# Altium schematic sheet USB.SchDoc: USB-PROGRAMMER
size A4; Engineer: M.GUENI; Revision: R0; SheetNumber: 6; SheetTotal: 8
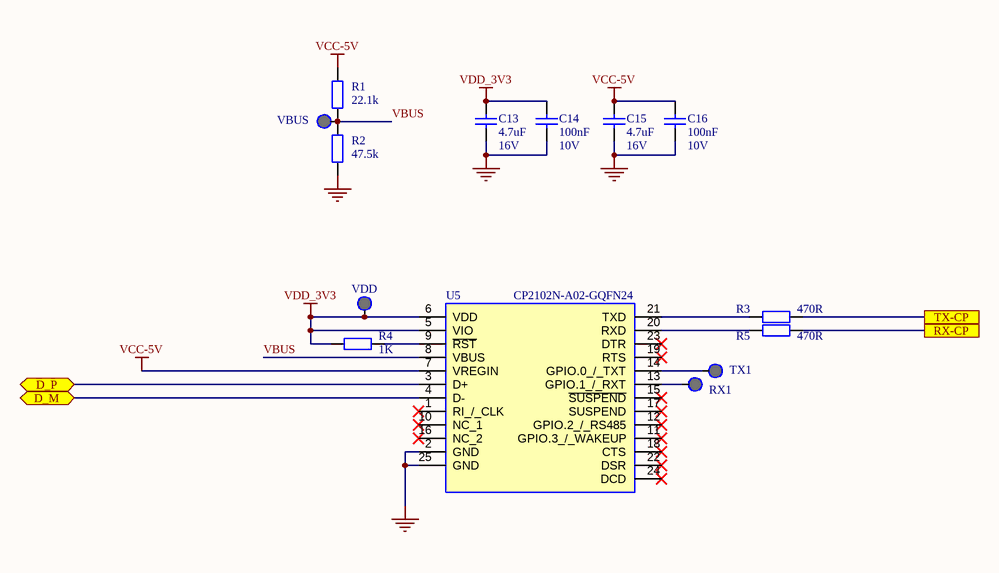
[diagram p0: USB.SchDoc]

## Parts
C13  Value 1: 4.7uF  Value 2: 16V  [CAPC1608N]  (hidden comment: Capacitor)
C14  Value 1: 100nF  Value 2: 10V  [CAPC1608N]  (hidden comment: Capacitor)
C15  Value 1: 4.7uF  Value 2: 16V  [CAPC1608N]  (hidden comment: Capacitor)
C16  Value 1: 100nF  Value 2: 10V  [CAPC1608N]  (hidden comment: Capacitor)
R1  Value 1: 22.1k  [RESC1608N]  (hidden comment: Resistor)
R2  Value 1: 47.5k  [RESC1608N]  (hidden comment: Resistor)
R3  Value 1: 470R  [RESC1608N]  (hidden comment: Resistor)
R4  Value 1: 1K  [RESC1608N]  (hidden comment: Resistor)
R5  Value 1: 470R  [RESC1608N]  (hidden comment: Resistor)
RX1  Test Point  [TP]  (value not drawn)  (no BOM)
TX1  Test Point  [TP]  (value not drawn)  (no BOM)
U5  CP2102N-A02-GQFN24  [QFN-24]
VBUS  Test Point  [TP]  (value not drawn)  (no BOM)
VDD  Test Point  [TP]  (value not drawn)  (no BOM)

## Ports
D_M (bidir), D_P (bidir), RX-CP, TX-CP

## Nets
GND: C13.1 C14.1 C15.1 C16.1 R2.2 U5.2(GND) U5.25(GND)
VCC-5V: C15.2 C16.2 R1.1 U5.7(VREGIN)
VDD_3V3: C13.2 C14.2 R4.1 U5.5(VIO) U5.6(VDD) VDD.1
D_M: U5.4(D-) ; port D_M
D_P: U5.3(D+) ; port D_P
RX-CP: R5.1 ; port RX-CP
TX-CP: R3.1 ; port TX-CP
VBUS: R1.2 R2.1 U5.8(VBUS) VBUS.1
NetR3_2: R3.2 U5.21(TXD)
NetR4_2: R4.2 U5.9(~{RST})
NetR5_2: R5.2 U5.20(RXD)
NetRX1_1: RX1.1 U5.13(GPIO.1_/_RXT)
NetTX1_1: TX1.1 U5.14(GPIO.0_/_TXT)

Not connected (* = marked no-connect by the designer): U5 1(RI_/_CLK)* 10(NC_1)* 11(GPIO.3_/_WAKEUP)* 12(GPIO.2_/_RS485)* 15(~{SUSPEND})* 16(NC_2)* 17(SUSPEND)* 18(CTS)* 19(RTS)* 22(DSR)* 23(DTR)* 24(DCD)*

## Notes on the sheet
- THIS DOCUMENT AND THE DATA DISCLOSED HEREIN OR
- HEREWITH IS THE PROPERTY OF ALTIUM LIMITED AND MAY
- DWG NO:
- REVISION
- REV:
- DESCRIPTION
- DATE
- APPROVED
- BE FREELY DISTRIBUTED IN WHOLE. NO RIGHTS ARE
- RESERVED OR EXPRESS OR IMPLIED WARANTEE GIVEN.
- ENG:
- APPROVALS
- PROJECT
- DSN:
- CHK:
- REFERENCE DOCUMENTS
- PROJECT REVISION:
- TITLE
- DOCUMENT REVISION:
- DESIGN ITEM:
- BOM:
- FAB DWG:
- PCB DWG:
- ASSY DWG:
- SCALE:
- A3
- SIZE
- CAGE CODE
- FILE NAME
- DWG NO.
- SHEET
- OF
- REV

## Library data of the parts
C13 C15 = CAP-000000047: MAN: Murata Electronics; MANREF: GRM188C71C475KE21D; DES: Multilayer Ceramic Capacitors MLCC - SMD/SMT 4.7UF 16V 10% 0603; TOL: 10%; FTP: 0603; SUP: Mouser; SUPREF: 81-GRM188C71C475KE1D; NOTE: _; Part Number: CAP-000000047
C14 C16 = CAP-000000005: MAN: KEMET; MANREF: C0603X104K8RACTU; DES: C0603X104K8RACTU -  Condensateur céramique multicouche CMS, 0.1 µF, 10 V, 0603 [1608 Metric], ± 10%, X7R; TOL: 10%; FTP: 0603; SUP: Farnell; SUPREF: 2904937; NOTE: _; Part Number: CAP-000000005
R1 = RES-000000017: MAN: Panasonic; MANREF: ERA-3AED2212V; DES: Thin Film Resistors - SMD 0603 22.1Kohms 25ppm 0.5% AEC-Q200; Value 2: 0.1W; TOL: 0.5%; FTP: 0603; SUP: Mouser; SUPREF: 667-ERA-3AED2212V; NOTE: _; Part Number: RES-000000017
R2 = RES-000000018: MAN: Vishay / Dale; MANREF: CRCW060347K5FKEA; DES: Thick Film Resistors - SMD 1/10watt 47.5Kohms 1%; Value 2: 0.1W; TOL: 1%; FTP: 0603; SUP: Mouser; SUPREF: 71-CRCW0603-47.5K-E3; NOTE: _; Part Number: RES-000000018
R3 R5 = RES-000000016: MAN: YAGEO; MANREF: RC0603FR-10470RL; DES: Thick Film Resistors - SMD 470 OHM 1%; Value 2: 0.1W; TOL: 1%; FTP: 0603; SUP: Mouser; SUPREF: 603-RC0603FR-10470RL; NOTE: _; Part Number: RES-000000016
R4 = RES-000000006: MAN: TE Connectivity / Neohm; MANREF: CPF0603F1K0C1; DES: Thin Film Resistors - SMD 1KOhm .063W 50PPM; Value 2: 0.625W; TOL: 1%; FTP: 0603; SUP: Mouser; SUPREF: 279-CPF0603F1K0C1; NOTE: _; Part Number: RES-000000006
RX1 TX1 VBUS VDD = MIS-000000003: MAN: _; Part Number: MIS-000000003; MANREF: _; DES: _; Value 1: _; Value 2: _; TOL: _; FTP: _; SUP: _; SUPREF: _; NOTE: _
U5 = MIS-000000025: MAN: SILICON LABS; DES: Circuit intégré d'interface USB USBXpress - USB to UART Bridge QFN24; Value 1: _; SUP: Mouser; SUPREF: 634-CP2102NA02GQFN24; Part Number: MIS-000000025; MANREF: CP2102N-A02-GQFN24; Value 2: _; TOL: _; FTP: QFN-24; NOTE: _